# Altium schematic sheet sensor.SchDoc
size A; SheetNumber: 3; SheetTotal: 3
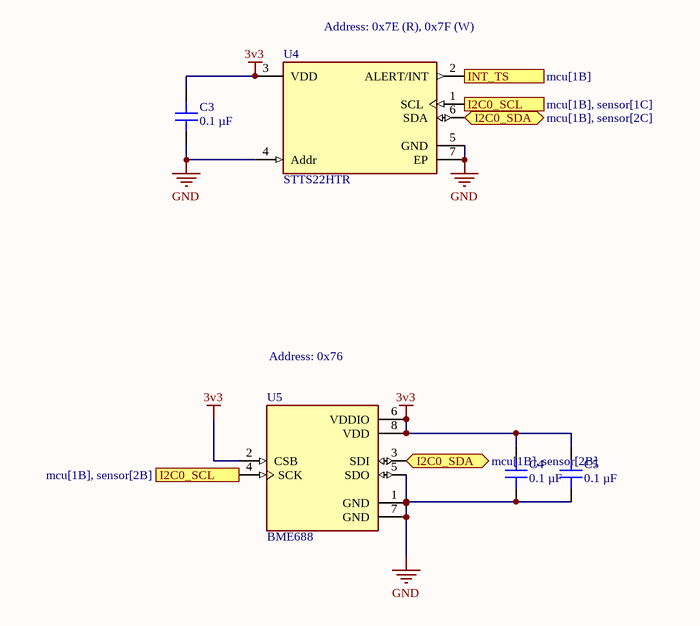
[diagram p0: sensor.SchDoc]

## Parts
C3  0.1 µF  [CAP 0402_1005]
C4  0.1 µF  [CAP 0402_1005]
C5  0.1 µF  [CAP 0402_1005]
U4  STTS22HTR  [FP-UDFN-6L-DM00423052-MFG]
U5  BME688  [IC_BME688]

## Ports
I2C0_SCL (in, see mcu[1B], sensor[1C]), I2C0_SCL (in, see mcu[1B], sensor[2B]), I2C0_SDA (bidir, see mcu[1B], sensor[2B]), I2C0_SDA (bidir, see mcu[1B], sensor[2C]), INT_TS (out, see mcu[1B])

## Nets
3v3: C3.2 C4.2 C5.2 U4.3(VDD) U5.2(CSB) U5.6(VDDIO) U5.8(VDD)
GND: C3.1 C4.1 C5.1 U4.4(Addr) U4.5(GND) U4.7(EP) U5.1(GND) U5.5(SDO) U5.7(GND)
I2C0_SCL: U4.1(SCL) U5.4(SCK) ; port I2C0_SCL
I2C0_SDA: U4.6(SDA) U5.3(SDI) ; port I2C0_SDA
INT_TS: U4.2(ALERT/INT) ; port INT_TS

## Notes on the sheet
- (near U4) Address: 0x7E (R), 0x7F (W)
- (near U5) Address: 0x76

## Library data of the parts
C3-C5 = C0402C104K7PAC7867: CAP CER 0.1UF 4V X5R 0402; manufacturer: KEMET; Tolerance: ±10%; Part Number: C0402C104K7PAC7867; Value: 0.1 µF; Applications: Bypass, Decoupling; Capacitance: 0.1 µF; componentlink1description: Datasheet; componentlink1url: https://api.kemet.com/component-edge/download/datasheet/C0402C104K7PAC7867.pdf; componentlink2description: DigiKey Link; componentlink2url: https://www.digikey.com/en/products/detail/kemet/C0402C104K7PAC7867/7381987; Device Package: 0402 (1005 Metric); lastupdated: 1/9/2022 12:30:40 pm; Lifecycle Status: Active; Minimum Order: 1; Mounting Type: Surface Mount, MLCC; Operating Temperature: -55°C ~ 85°C; Package / Case: 0402 (1005 Metric); packaging: TapeAndReel; partid: 5603; Part Status: Active; price: 0.01; series: SMD Comm X5R; Size / Dimension: 0.039" L x 0.020" W (1.00mm x 0.50mm); Supplier 1: DigiKey; Supplier Part Number 1: 399-14871-1-ND; Temperature Coefficient: X5R; Thickness (Max): 0.022" (0.55mm); Voltage - Rated: 4V
U4 = CMP-12184-000002-1: LOW-VOLTAGE, ULTRA-LOW-POWER, 0.; Manufacturer: STMicroelectronics; Max Supply Voltage: 3.6V; Sensor Output: I2C,SMBus; Min Supply Voltage: 1.5V; Resolution: 16bits; Standoff Height: 0mm; Operating Supply Current: 1.75-120uA; Octopart: https://octopart.com/stts22htr-stmicroelectronics-103417944; Temperature: -40°C to +125°C; Interface: I2C,SMBus; ComponentLink2Description: Datasheet; Device Class L3: unset; Lead Free: Yes; Temperature Range Low: -40°C; ComponentLink2URL: https://www.st.com/resource/en/datasheet/stts22h.pdf; Temperature Range High: +125°C; RoHS: TRUE; Automotive: No; Device Class L1: Sensors; Category: IC; Manufacturer Part Number: STTS22HTR; Package: UDFN-6L-DM00423052; Device Class L2: Temperature and Humidity Sensors; Mouser Description: Low-voltage, ultra-low-power, 0.5 ï¿½C accuracy Iï¿½C/SMBus 3.0 temperature sensor; Digikey Description: LOW-VOLTAGE, ULTRA-LOW-POWER, 0.; Height: 0.55mm
U5 = BME688: Gas sensor measuring relative humidity, barometric pressure, ambient temperature and gas (VOC); Package: None; MP: BME688; Price: None; Availability: Unavailable; Value: *